# EasyEDA Pro project Module24Switches_TH_2025.epro

# Schematic Module24Switches_TH_REV1
Board Name: Module24Switches_TH_REV1; Create Date: 2025-06-26; Page Name: Main; Project Name: Module24Switches_TH_2025; Schematic Name: Module24Switches_TH_REV1; Update Date: 2025-06-26; Add into BOM: yes; Company: Open source ESP32 Sim Wheel; Convert to PCB: yes; Date: 2025-06-25; Draw By: afpineda; REV: 1.0; Sheet: 1/1; spicePre: .
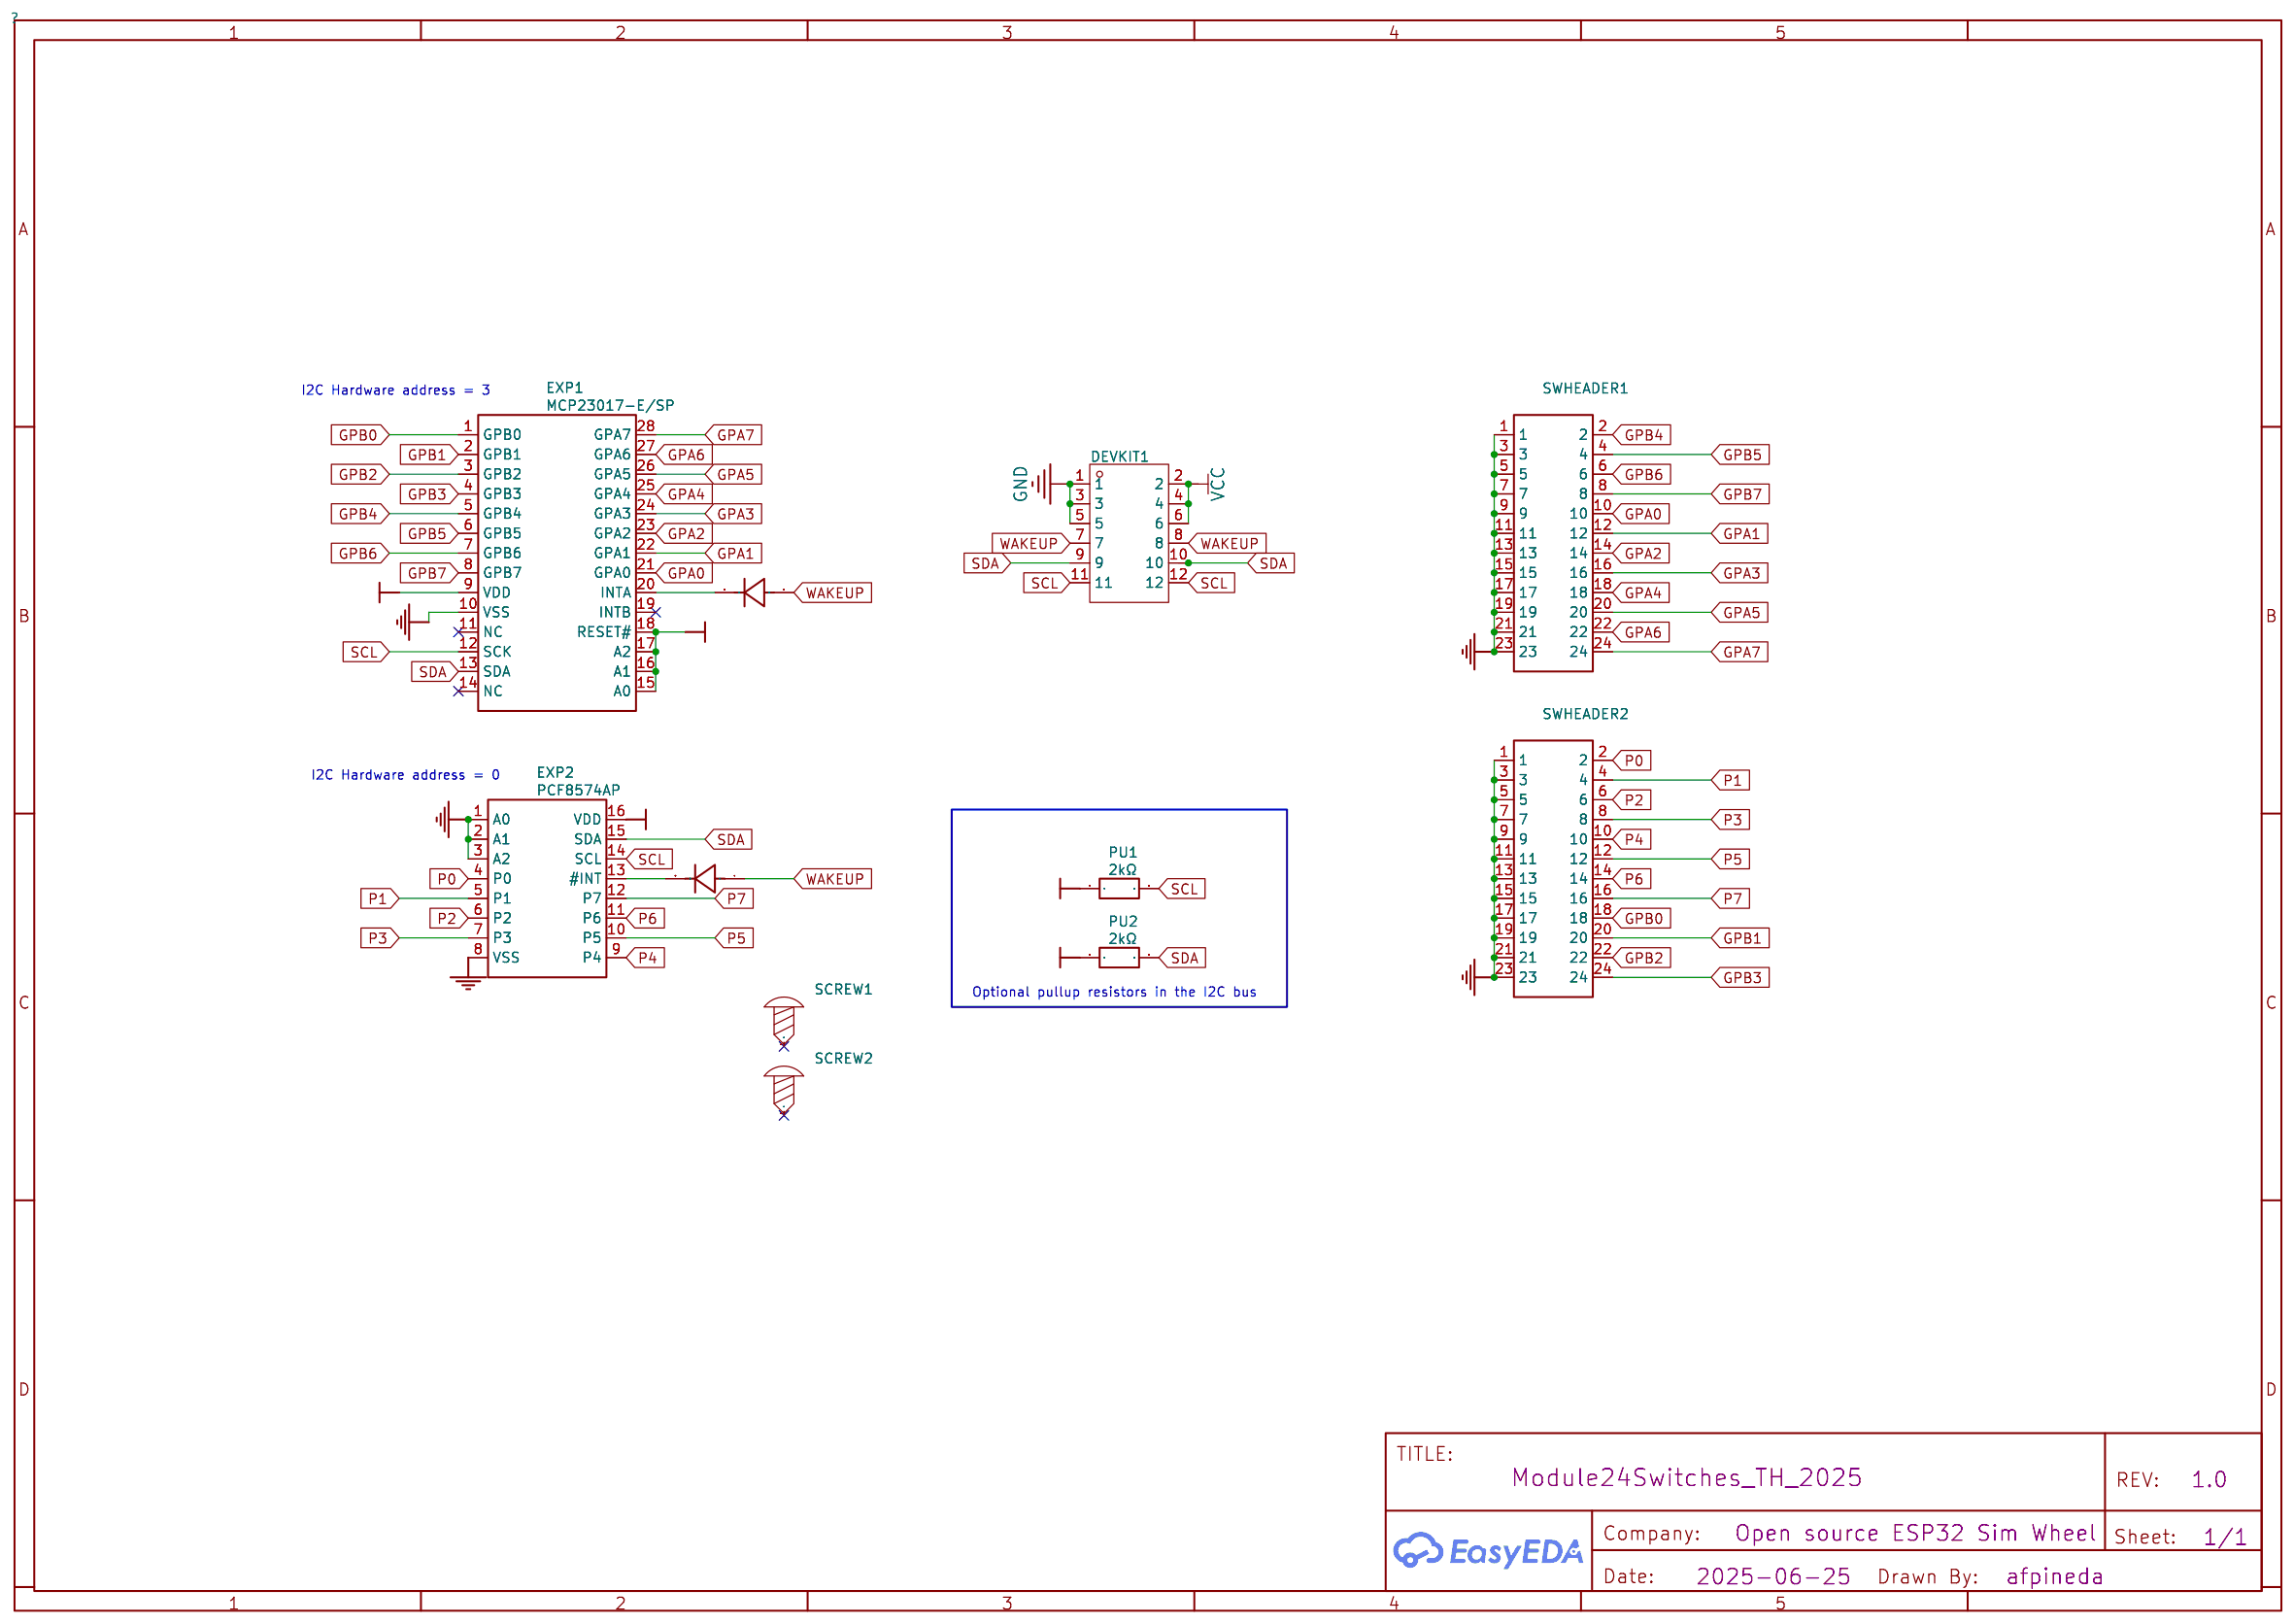
[diagram p0: schematic sheet]

## Parts
D1  1N4148_C18195411  [DO-35_BD2.2-L4.0-D0.50_1N4148]  (no BOM)
D2  1N4148_C18195411  [DO-35_BD2.2-L4.0-D0.50_1N4148]  (no BOM)
DEVKIT1  2541WR-2x06P  [HDR-TH_12P-P2.54-H-M-R2-C6-S2.54-N]
EXP1  MCP23017-E/SP  [DIP-28_L34.6-W7.3-P2.54-LS10.2-BL]  (no BOM)
EXP2  PCF8574AP  [DIP-16_L19.2-W6.6-P2.54-LS7.6-BL]  (no BOM)
PU1  2kΩ  [RES-TH_BD2.4-L6.3-P10.30-D0.6]  (no BOM)
PU2  2kΩ  [RES-TH_BD2.4-L6.3-P10.30-D0.6]  (no BOM)
SCREW1  -  [Screw-Hole-M2]  (no BOM)
SCREW2  -  [Screw-Hole-M2]  (no BOM)
SWHEADER1  2541WR-2x12P  [HDR-TH_24P-P2.54-H-M-R2-C12-S2.54-N]  (no BOM)
SWHEADER2  2541WR-2x12P  [HDR-TH_24P-P2.54-H-M-R2-C12-S2.54-N]  (no BOM)

## Library data of the parts
D1 D2 = 1N4148_C18195411: Supplier: LCSC; Supplier Part: C18195411; Manufacturer: LJ(朗捷); Manufacturer Part: 1N4148; JLCPCB Part Class: Extended Part; Contributor: lcsc; spicePre: D
DEVKIT1 = 2541WR-2x06P: Pin Structure:2x6P Pitch:2.54mm Circluar Pins/Square Pins:Policy Mounting Type:Right-Angle Number of Rows:Double Row Number of Pins:12P Length of Mating Pin:6mm Insulation Height:2.5mm Contact Plating:Gold Operating Temperature:-40℃~+105℃ Operating Temper; LCSC Part Name: 2x6P 间距:2.54mm 方针 弯插; Supplier Part: C5383091; Manufacturer: HanElectricity(瀚源); Supplier Footprint: 弯插,P=2.54mm; JLCPCB Part Class: Extended Part; Datasheet: https://atta.szlcsc.com/upload/public/pdf/source/20230330/FE4D889090FF16F85128307BD79BAA8F.pdf; Supplier: LCSC; Pin Structure: 2x6P; Pitch: 2.54mm; Circluar Pins/Square Pins: Policy; Mounting Type: Right-Angle; Number of Rows: Double Row; Number of Pins: 12P; Length of Mating Pin: 6mm; Insulation Height: 2.5mm; Contact Plating: Gold; Operating Temperature: -40℃~+105℃
EXP1 = MCP23017-E/SP: Supplier: LCSC; Supplier Part: C647352; Manufacturer: MICROCHIP(美国微芯); JLCPCB Part Class: Extended Part; Contributor: LCSC; spicePre: U
EXP2 = PCF8574AP: Supplier: LCSC; Supplier Part: C398072; Manufacturer: HGSEMI(华冠); JLCPCB Part Class: Extended Part; Contributor: LCSC; spicePre: U
PU1 PU2 = RN1/4W2KFT/BA1: Type:Metal Film Resistors Resistance:2kΩ Tolerance:±1% Tolerance:±1% Voltage-Supply(Max):250V Power(Watts):1/4W Temperature Coefficient:±50ppm/℃ Temperature Coefficient:±50ppm/℃ Operating Temperature:-55℃~+125℃ Operating Temperature:-55℃~+125℃; LCSC Part Name: 2kΩ ±1% 250mW 金属膜电阻; Supplier Part: C410663; Manufacturer: Tyohm(幸亚电阻); Supplier Footprint: 插件,D2.4xL6.5mm; JLCPCB Part Class: Extended Part; Datasheet: https://atta.szlcsc.com/upload/public/pdf/source/20190808/C410699_D126E64D28B638F1D73B58E9F61DFD9B.pdf; Supplier: LCSC; Type: Metal Film Resistors; Tolerance: ±1%; Voltage-Supply(Max): 250V; Power(Watts): 1/4W; Temperature Coefficient: ±50ppm/℃; Operating Temperature: -55℃~+125℃
SCREW1 SCREW2 = Screw-Hole-M2: Supplier Footprint: 插件
SWHEADER1 SWHEADER2 = 2541WR-2x12P: Pin Structure:2x12P Pitch:2.54mm Circluar Pins/Square Pins:Policy Mounting Type:Right-Angle Number of Rows:Double Row Number of Pins:24P Length of Mating Pin:6mm Insulation Height:2.5mm Contact Plating:Gold Operating Temperature:-40℃~+105℃ Operating Tempe; LCSC Part Name: 2x12P 间距:2.54mm 方针 弯插; Supplier Part: C5383094; Manufacturer: HanElectricity(瀚源); Supplier Footprint: 弯插,P=2.54mm; JLCPCB Part Class: Extended Part; Datasheet: https://atta.szlcsc.com/upload/public/pdf/source/20230330/FE4D889090FF16F85128307BD79BAA8F.pdf; Supplier: LCSC; Pin Structure: 2x12P; Pitch: 2.54mm; Circluar Pins/Square Pins: Policy; Mounting Type: Right-Angle; Number of Rows: Double Row; Number of Pins: 24P; Length of Mating Pin: 6mm; Insulation Height: 2.5mm; Contact Plating: Gold; Operating Temperature: -40℃~+105℃

## Nets
GND: DEVKIT1.1 DEVKIT1.3 DEVKIT1.5 EXP1.10(VSS) EXP2.1(A0) EXP2.2(A1) EXP2.3(A2) EXP2.8(VSS) SWHEADER1.1 SWHEADER1.3 SWHEADER1.5 SWHEADER1.7 SWHEADER1.9 SWHEADER1.11 SWHEADER1.13 SWHEADER1.15 SWHEADER1.17 SWHEADER1.19 SWHEADER1.21 SWHEADER1.23 SWHEADER2.1 SWHEADER2.3 SWHEADER2.5 SWHEADER2.7 SWHEADER2.9 SWHEADER2.11 SWHEADER2.13 SWHEADER2.15 SWHEADER2.17 SWHEADER2.19 SWHEADER2.21 SWHEADER2.23
VCC: DEVKIT1.2 DEVKIT1.4 DEVKIT1.6 EXP1.9(VDD) EXP1.15(A0) EXP1.16(A1) EXP1.17(A2) EXP1.18(RESET#) EXP2.16(VDD) PU1.1 PU2.1
GPA0: EXP1.21(GPA0) SWHEADER1.10
GPA1: EXP1.22(GPA1) SWHEADER1.12
GPA2: EXP1.23(GPA2) SWHEADER1.14
GPA3: EXP1.24(GPA3) SWHEADER1.16
GPA4: EXP1.25(GPA4) SWHEADER1.18
GPA5: EXP1.26(GPA5) SWHEADER1.20
GPA6: EXP1.27(GPA6) SWHEADER1.22
GPA7: EXP1.28(GPA7) SWHEADER1.24
GPB0: EXP1.1(GPB0) SWHEADER2.18
GPB1: EXP1.2(GPB1) SWHEADER2.20
GPB2: EXP1.3(GPB2) SWHEADER2.22
GPB3: EXP1.4(GPB3) SWHEADER2.24
GPB4: EXP1.5(GPB4) SWHEADER1.2
GPB5: EXP1.6(GPB5) SWHEADER1.4
GPB6: EXP1.7(GPB6) SWHEADER1.6
GPB7: EXP1.8(GPB7) SWHEADER1.8
P0: EXP2.4(P0) SWHEADER2.2
P1: EXP2.5(P1) SWHEADER2.4
P2: EXP2.6(P2) SWHEADER2.6
P3: EXP2.7(P3) SWHEADER2.8
P4: EXP2.9(P4) SWHEADER2.10
P5: EXP2.10(P5) SWHEADER2.12
P6: EXP2.11(P6) SWHEADER2.14
P7: EXP2.12(P7) SWHEADER2.16
SCL: DEVKIT1.11 DEVKIT1.12 EXP1.12(SCK) EXP2.14(SCL) PU1.2
SDA: DEVKIT1.9 DEVKIT1.10 EXP1.13(SDA) EXP2.15(SDA) PU2.2
WAKEUP: D1.1(A) D2.1(A) DEVKIT1.7 DEVKIT1.8
$1N8: D1.2(C) EXP1.20(INTA)
$1N19: D2.2(C) EXP2.13(#INT)

Not connected (* = marked no-connect by the designer): EXP1 11(NC)* 14(NC)* 19(INTB)*; SCREW1 1*; SCREW2 1*

## Notes on the sheet
- I2C Hardware address = 3
- I2C Hardware address = 0
- Optional pullup resistors in the I2C bus

# Board PCB24SW_TH_REV1
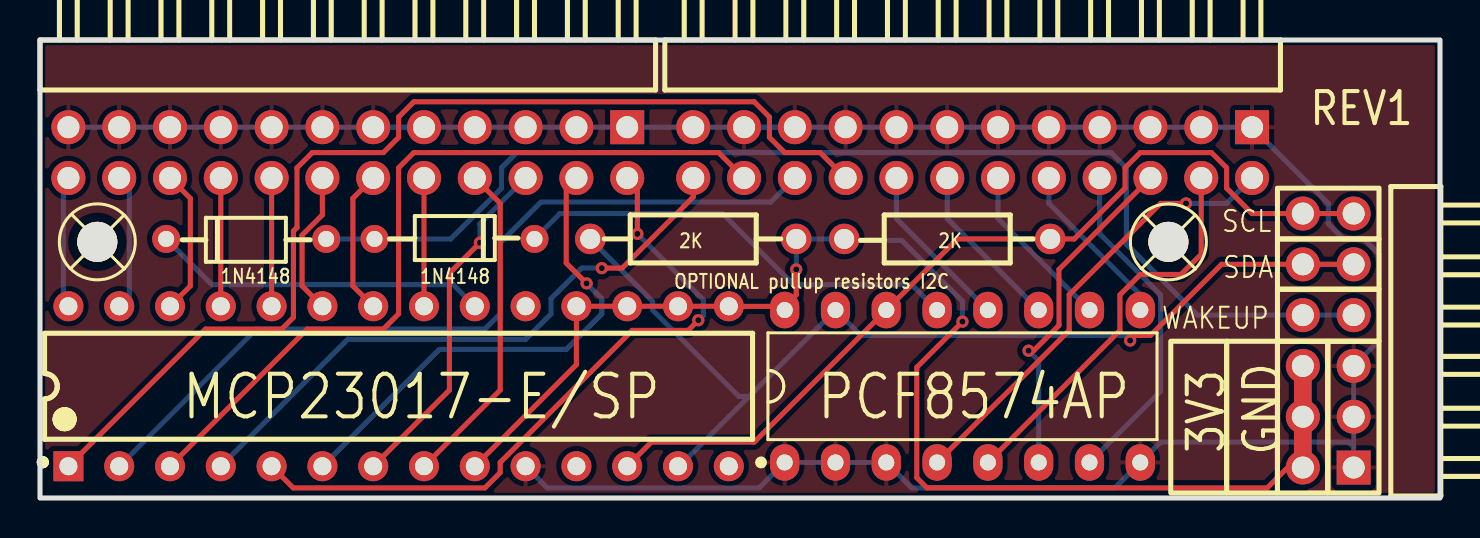
[diagram p1: board, top side]
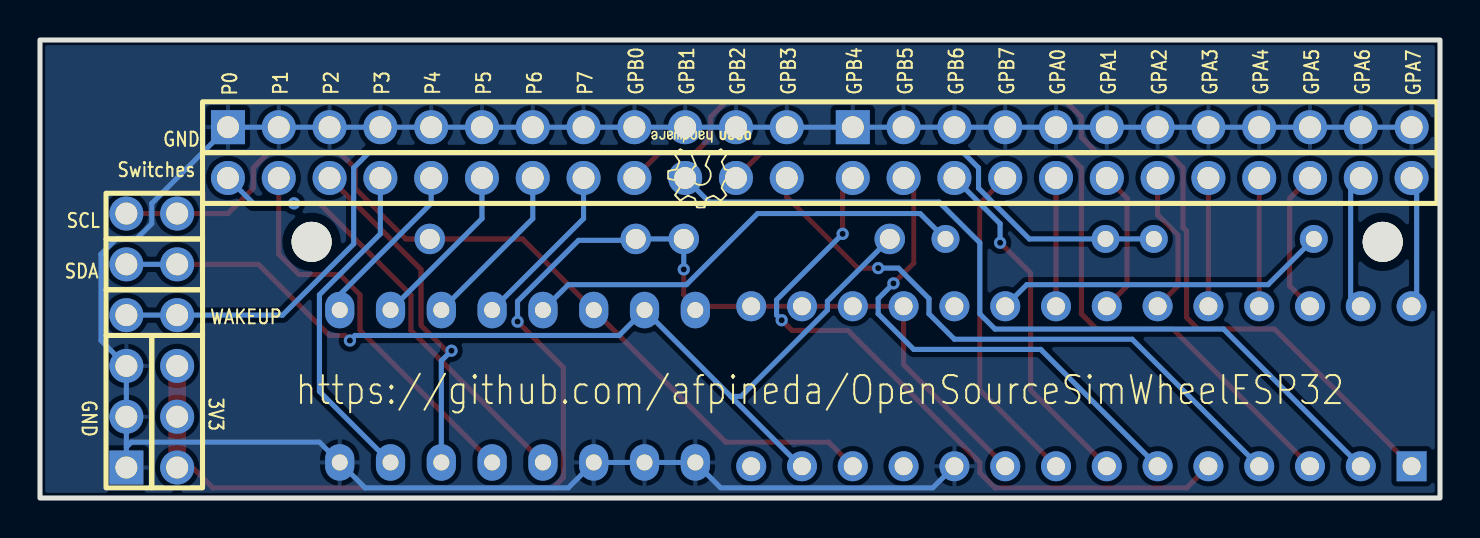
[diagram p2: board, bottom side, seen from below]

Outline 70 x 22.9 mm; copper layers: Top Layer, Bottom Layer. Coordinates in mm from the lower left corner of the outline.
Outline path: rectangle 0,22.9 70,0
Stack: Top Layer 0.035mm / Dielectric1 1.51mm FR4 er 4.5 / Bottom Layer 0.035mm

## Design rules (mm)
template: JLCPCB Capability(Two Layers Board)
spacing copperThickness1oz (default): track to track 0.102, other pairs 0.152 to 0.3
spacing copperThickness2oz: track to track 0.203, other pairs 0.152 to 0.3
track width copperThickness1oz (default): min 0.127, default 0.254, max 2.54
track width copperThickness2oz: min 0.203, default 0.254, max 2.54
differential pair differentialPair (default): width min 0.127, default 0.254, max 2.54; gap min 0.152, default 0.152
via viaSize (default): diameter min 0.5, default 0.61, max 10; hole min 0.3, default 0.305, max 6.3

## Placement (name value [footprint] x y rotation side)
D1  1N4148_C18195411  [DO-35_BD2.2-L4.0-D0.50_1N4148]  10.31 12.95 180 top
D2  1N4148_C18195411  [DO-35_BD2.2-L4.0-D0.50_1N4148]  20.72 12.95 0 top
DEVKIT1  2541WR-2x06P  [HDR-TH_12P-P2.54-H-M-R2-C6-S2.54-N]  64.41 7.87 90 top
EXP1  MCP23017-E/SP  [DIP-28_L34.6-W7.3-P2.54-LS10.2-BL]  17.93 5.59 0 top
EXP2  PCF8574AP  [DIP-16_L19.2-W6.6-P2.54-LS7.6-BL]  46.12 5.59 0 top
PU1  2kΩ  [RES-TH_BD2.4-L6.3-P10.30-D0.6]  45.36 12.95 0 top
PU2  2kΩ  [RES-TH_BD2.4-L6.3-P10.30-D0.6]  32.66 12.95 180 top
SCREW1  -  [Screw-Hole-M2]  2.86 12.81 0 top
SCREW2  -  [Screw-Hole-M2]  56.42 12.81 0 top
SWHEADER1  2541WR-2x12P  [HDR-TH_24P-P2.54-H-M-R2-C12-S2.54-N]  15.39 17.27 180 top
SWHEADER2  2541WR-2x12P  [HDR-TH_24P-P2.54-H-M-R2-C12-S2.54-N]  46.63 17.27 180 top

## Footprints (pads in the part's own frame, mm; a bottom-side part is the same pattern mirrored in y, then rotated)
DIP-16_L19.2-W6.6-P2.54-LS7.6-BL
  oval 1.46x1.825 hole 0.8: 1(-8.89,-3.81) 2(-6.35,-3.81) 3(-3.81,-3.81) 4(-1.27,-3.81) 5(1.27,-3.81) 6(3.81,-3.81) 7(6.35,-3.81) 8(8.89,-3.81) 9(8.89,3.81) 10(6.35,3.81) 11(3.81,3.81) 12(1.27,3.81) 13(-1.27,3.81) 14(-3.81,3.81) 15(-6.35,3.81) 16(-8.89,3.81)
DIP-28_L34.6-W7.3-P2.54-LS10.2-BL
  rect 1.5x1.5 hole 0.9: 1(-16.51,-4)
  round 1.5 hole 0.9: 2(-13.97,-4) 3(-11.43,-4) 4(-8.89,-4) 5(-6.35,-4) 6(-3.81,-4) 7(-1.27,-4) 8(1.27,-4) 9(3.81,-4) 10(6.35,-4) 11(8.89,-4) 12(11.43,-4) 13(13.97,-4) 14(16.51,-4) 15(16.51,4) 16(13.97,4) 17(11.43,4) 18(8.89,4) 19(6.35,4) 20(3.81,4) 21(1.27,4) 22(-1.27,4) 23(-3.81,4) 24(-6.35,4) 25(-8.89,4) 26(-11.43,4) 27(-13.97,4) 28(-16.51,4)
DO-35_BD2.2-L4.0-D0.50_1N4148
  round 1.4 hole 0.8: 1(-4,0) 2(4,0)
HDR-TH_12P-P2.54-H-M-R2-C6-S2.54-N
  rect 1.7x1.7 hole 1.1: 1(-6.35,-1.27)
  round 1.7 hole 1.1: 2(-6.35,1.27) 3(-3.81,-1.27) 4(-3.81,1.27) 5(-1.27,-1.27) 6(-1.27,1.27) 7(1.27,-1.27) 8(1.27,1.27) 9(3.81,-1.27) 10(3.81,1.27) 11(6.35,-1.27) 12(6.35,1.27)
HDR-TH_24P-P2.54-H-M-R2-C12-S2.54-N
  rect 1.7x1.7 hole 1.1: 1(-13.97,-1.27)
  round 1.7 hole 1.1: 2(-13.97,1.27) 3(-11.43,-1.27) 4(-11.43,1.27) 5(-8.89,-1.27) 6(-8.89,1.27) 7(-6.35,-1.27) 8(-6.35,1.27) 9(-3.81,-1.27) 10(-3.81,1.27) 11(-1.27,-1.27) 12(-1.27,1.27) 13(1.27,-1.27) 14(1.27,1.27) 15(3.81,-1.27) 16(3.81,1.27) 17(6.35,-1.27) 18(6.35,1.27) 19(8.89,-1.27) 20(8.89,1.27) 21(11.43,-1.27) 22(11.43,1.27) 23(13.97,-1.27) 24(13.97,1.27)
RES-TH_BD2.4-L6.3-P10.30-D0.6
  round 1.524 hole 1: 1(-5.15,0) 2(5.15,0)
Screw-Hole-M2
  round 2 hole 2.4: 1(0,0)

## Nets
As in the schematic.

Pads without a net: EXP1 11 14 19; SCREW1 1; SCREW2 1

## Via types
v1: diameter 0.61, hole 0.305, Top Layer to Bottom Layer, 10 vias

## Routing (per net, layer and track width the routed paths; a pad name or vN(x,y) marks a point on that pad's centre or on a via; arc(x,y) is an arc through that point)
GND: length 123.9
  Bottom Layer w0.254: DEVKIT1.1 65.68,2.54 ; 65.68,2.54 65.43,2.79 56.03,2.79 EXP2.8 53.74,0.51 43.58,0.51 EXP2.3 EXP2.2 EXP2.1 35.96,0.51 25.36,0.51 EXP1.10 ; 65.68,2.54 DEVKIT1.3 DEVKIT1.5 66.95,7.87 66.95,12.19 66.19,12.95 65.17,12.95 64.41,13.72 64.41,14.73 SWHEADER2.1 SWHEADER2.3 SWHEADER2.5 SWHEADER2.7 SWHEADER2.9 SWHEADER2.11 SWHEADER2.13 SWHEADER2.15 SWHEADER2.17 SWHEADER2.19 SWHEADER2.21 SWHEADER2.23 SWHEADER1.1 SWHEADER1.3 SWHEADER1.5 SWHEADER1.7 SWHEADER1.9 SWHEADER1.11 SWHEADER1.13 SWHEADER1.15 SWHEADER1.17 SWHEADER1.19 SWHEADER1.21 SWHEADER1.23
VCC: length 69
  Top Layer w0.254: DEVKIT1.2 63.14,2.29 61.36,0.51 44.35,0.51 43.84,1.02 43.84,6.53 v1(46.12,8.82) ; 37.23,9.58 34.45,9.58 ; 37.23,9.58 EXP2.16 ; 37.23,9.58 37.81,10.16 v1(37.81,11.43) ; EXP1.9 26.82,6.67 EXP1.18 EXP1.17 EXP1.16 EXP1.15
  Top Layer w0.889: 63.14,2.29 DEVKIT1.4 DEVKIT1.6
  Bottom Layer w0.254: v1(46.12,8.82) 46.12,9.84 43.08,12.88 40.28,12.88 PU1.1 PU2.1 v1(37.81,11.43)
GPA0: length 6.4
  Top Layer w0.254: EXP1.21 SWHEADER1.10
GPA1: length 7.3
  Top Layer w0.254: EXP1.22 15.64,10.6 15.64,14.99 SWHEADER1.12
GPA2: length 7.3
  Top Layer w0.254: SWHEADER1.14 14.12,14.16 13.1,13.14 13.1,10.6 EXP1.23
GPA3: length 6.4
  Top Layer w0.254: EXP1.24 SWHEADER1.16
GPA4: length 6.4
  Top Layer w0.254: EXP1.25 SWHEADER1.18
GPA5: length 7.3
  Top Layer w0.254: EXP1.26 7.52,10.6 7.52,14.99 SWHEADER1.20
GPA6: length 6.8
  Bottom Layer w0.254: SWHEADER1.22 4.47,15.49 4.47,10.1 EXP1.27
GPA7: length 6.6
  Bottom Layer w0.254: EXP1.28 1.17,9.84 1.17,15.75 SWHEADER1.24
GPB0: length 53.5
  Top Layer w0.254: SWHEADER2.18 39.01,17.27 37.23,17.27 36.47,18.03 36.47,19.05 35.71,19.81 18.69,19.81 17.93,19.05 17.93,18.03 17.17,17.27 13.61,17.27 12.85,16.51 12.85,13.53 12.67,13.35 12.67,9.03 12.09,8.45 8.28,8.45 EXP1.1
GPB1: length 41.8
  Bottom Layer w0.254: EXP1.2 10.82,8.45 22.25,8.45 23.01,9.21 23.01,12.76 25.04,14.8 36.54,14.8 SWHEADER2.20
GPB2: length 40
  Top Layer w0.254: SWHEADER2.22 33.93,17.27 18.69,17.27 17.93,16.51 17.93,9.21 17.17,8.45 13.36,8.45 EXP1.3
GPB3: length 30.6
  Top Layer w0.254: SWHEADER2.24 32.66,15.05 29.11,11.49 v1(28.09,11.49)
  Bottom Layer w0.254: EXP1.4 15.39,7.94 24.28,7.94 25.55,9.21 25.55,9.97 27.07,11.49 v1(28.09,11.49)
GPB4: length 34.3
  Top Layer w0.254: v1(29.87,13.21) 29.87,15.49 SWHEADER1.2 ; v1(32.92,8.89) 32.41,8.38 29.61,8.38 23.01,1.78 23.01,1.27 22.25,0.51 12.66,0.51 EXP1.5
  Bottom Layer w0.254: v1(29.87,13.21) 33.17,9.91 33.17,9.14 v1(32.92,8.89)
GPB5: length 24.9
  Top Layer w0.254: v1(27.33,10.73) 26.31,11.75 26.31,15.49 SWHEADER1.4
  Bottom Layer w0.254: v1(27.33,10.73) 28.09,9.97 28.09,9.21 26.31,7.43 19.96,7.43 EXP1.6
GPB6: length 17.6
  Top Layer w0.254: v1(21.99,12.76) 20.47,11.24 20.47,5.4 EXP1.7
  Bottom Layer w0.254: v1(21.99,12.76) 21.99,13.72 SWHEADER1.6
GPB7: length 16.5
  Top Layer w0.254: SWHEADER1.8 23.01,14.73 23.01,5.4 EXP1.8
P0: length 22.7
  Top Layer w0.254: EXP2.4 51.46,8.38 51.46,10.16 56.03,14.73 v1(57.3,14.73)
  Bottom Layer w0.254: SWHEADER2.2 59.33,14.73 v1(57.3,14.73)
P1: length 19.8
  Top Layer w0.254: SWHEADER2.4 58.06,12.19 57.05,11.18 55.01,11.18 54,10.16 54,8.38 EXP2.5
P2: length 17.1
  Top Layer w0.254: SWHEADER2.6 50.95,11.43 50.95,8.64 49.68,7.37 v1(49.43,7.37)
  Bottom Layer w0.254: EXP2.6 49.93,6.86 v1(49.43,7.37)
P3: length 17
  Bottom Layer w0.254: EXP2.7 56.03,5.33 56.03,10.16 52.98,13.21 SWHEADER2.8
P4: length 8.5
  Bottom Layer w0.254: EXP2.9 55.01,10.16 50.44,14.73 SWHEADER2.10
P5: length 8.5
  Bottom Layer w0.254: SWHEADER2.12 47.9,13.97 EXP2.10
P6: length 8.5
  Bottom Layer w0.254: EXP2.11 45.36,13.97 SWHEADER2.14
P7: length 8.5
  Bottom Layer w0.254: SWHEADER2.16 42.82,13.97 EXP2.12
SCL: length 45.3
  Top Layer w0.254: EXP1.12 30.57,2.79 35.71,2.79 EXP2.14 45.87,12.95 PU1.2 51.71,12.95 54.25,15.49 54.25,16.51 55.01,17.27 58.57,17.27 59.33,16.51 59.33,15.49 60.6,14.22 DEVKIT1.12 DEVKIT1.11
SDA: length 53.2
  Top Layer w0.254: v1(54.51,7.87) 54.76,8.13 55.52,8.13 59.08,11.68 DEVKIT1.10 DEVKIT1.9
  Bottom Layer w0.254: PU2.2 30.63,9.84 30.63,9.4 34.95,5.08 35.46,5.08 ; EXP1.13 31.96,1.59 35.46,5.08 ; DEVKIT1.9 DEVKIT1.10 ; 35.46,5.08 EXP2.15 41.04,8.13 54.25,8.13 v1(54.51,7.87)
WAKEUP: length 59.4
  Bottom Layer w0.254: DEVKIT1.7 DEVKIT1.8 57.87,9.14 54.32,12.7 54.32,16.51 53.55,17.27 23.84,17.27 23.07,16.51 23.07,15.49 20.53,12.95 D2.1 D1.1
$1N8: length 16.8
  Bottom Layer w0.254: EXP1.20 20.66,10.67 8.6,10.67 D1.2
$1N19: length 22.7
  Bottom Layer w0.254: D2.2 25.99,14.22 34.12,14.22 37.68,10.67 43.58,10.67 EXP2.13

## Copper pours and planes (outline as drawn; the poured copper is in the pictures)
GND on Top Layer: 0,22.9 70,22.9 70,0 0,0
GND on Bottom Layer: 0,22.9 70,22.9 70,0 0,0

## Text on the board
Bottom Silkscreen Layer: WAKEUP | GND | Switches | SCL | SDA | 3V3 | GPA7 | GPA6 | GPA5 | GPA4 | GPA3 | GPA2 | GPA1 | GPA0 | GPB7 | GPB6 | GPB5 | GPB4 | GPB3 | GPB2 | GPB1 | GPB0 | P7 | P6 | P5 | P4 | P3 | P2 | P1 | P0 | https://github.com/afpineda/OpenSourceSimWheelESP32
Top Silkscreen Layer: 1N4148 | OPTIONAL pullup resistors I2C | 2K | WAKEUP | SCL | SDA | REV1 | 3V3 | GND | MCP23017-E/SP | PCF8574AP
